# Altium schematic sheet Motor_Drivers.SchDoc
size 431 x 279 mm; SheetNumber: 4; SheetTotal: 4
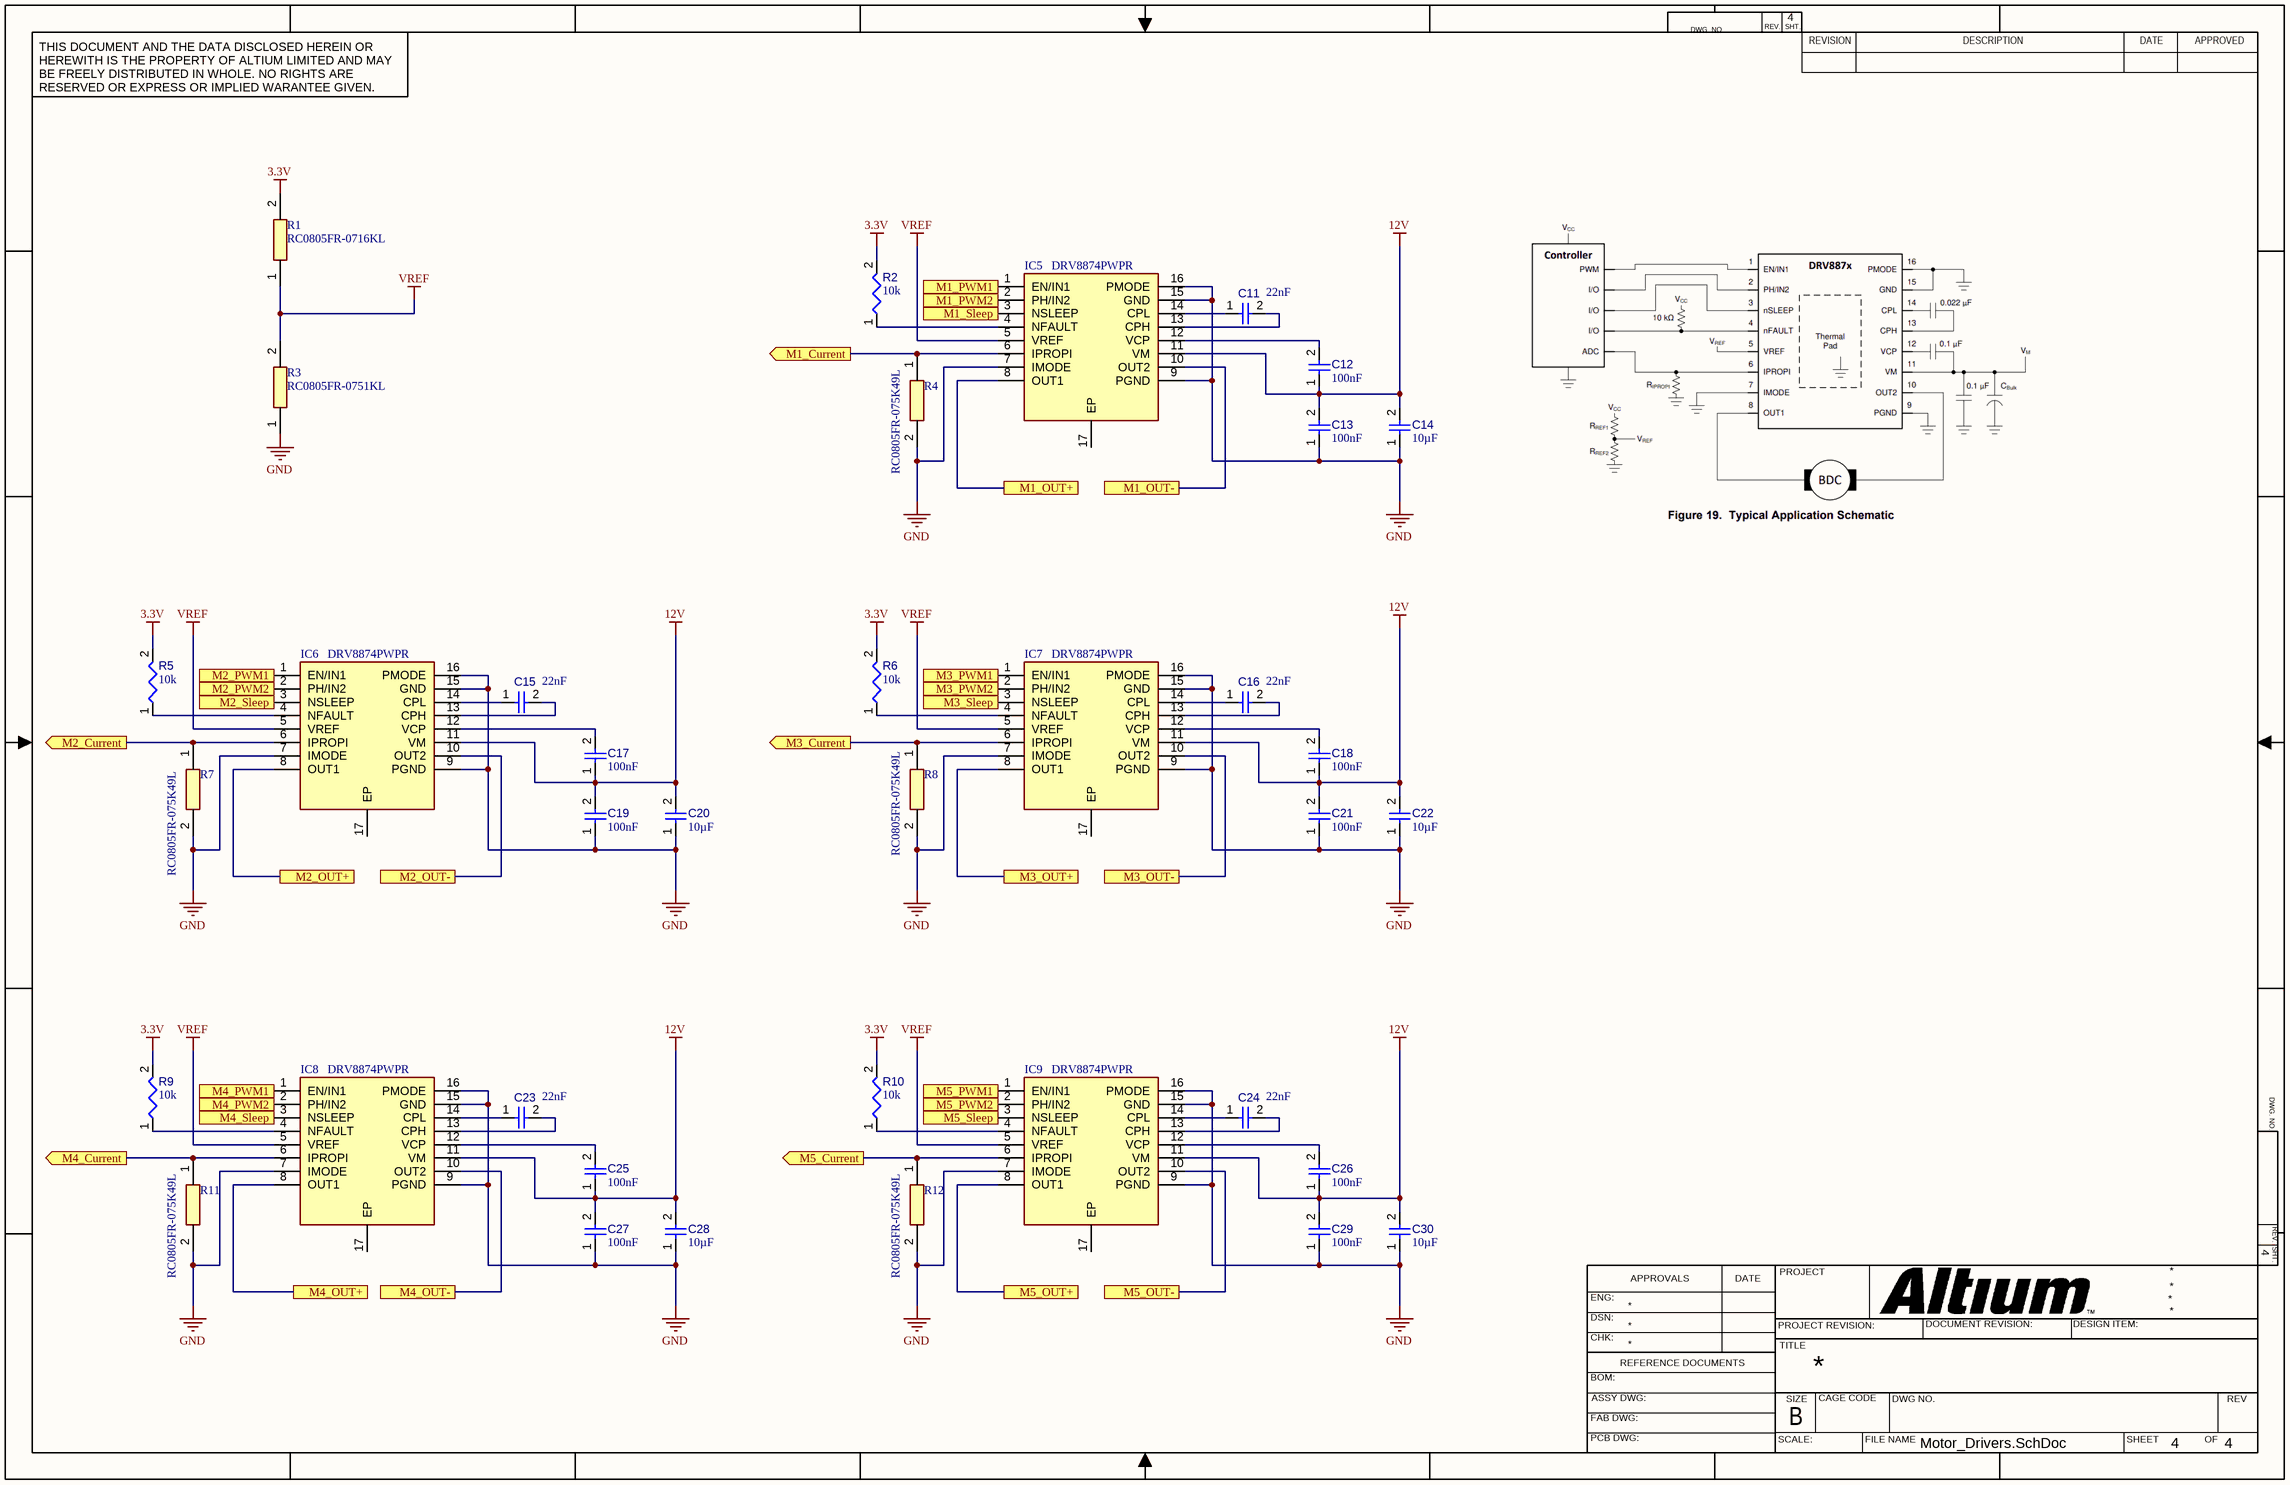
[diagram p0: Motor_Drivers.SchDoc]

## Parts
C11  value 22nF  [CAPC0402(1005)60_L]  (hidden comment: Capacitor 22nF +/-20% 10V 0402)
C12  value 100nF  [CAPC2013X95X50LL10T25]  (hidden comment: Capacitor 100 nF +/-10% 50 V 0805)
C13  value 100nF  [CAPC2013X95X50LL10T25]  (hidden comment: Capacitor 100 nF +/-10% 50 V 0805)
C14  value 10µF  [CAPC0805(2012)145_L]  (hidden comment: Capacitor 10µF +/-20% 25V 0805)
C15  value 22nF  [CAPC0402(1005)60_L]  (hidden comment: Capacitor 22nF +/-20% 10V 0402)
C16  value 22nF  [CAPC0402(1005)60_L]  (hidden comment: Capacitor 22nF +/-20% 10V 0402)
C17  value 100nF  [CAPC2013X95X50LL10T25]  (hidden comment: Capacitor 100 nF +/-10% 50 V 0805)
C18  value 100nF  [CAPC2013X95X50LL10T25]  (hidden comment: Capacitor 100 nF +/-10% 50 V 0805)
C19  value 100nF  [CAPC2013X95X50LL10T25]  (hidden comment: Capacitor 100 nF +/-10% 50 V 0805)
C20  value 10µF  [CAPC0805(2012)145_L]  (hidden comment: Capacitor 10µF +/-20% 25V 0805)
C21  value 100nF  [CAPC2013X95X50LL10T25]  (hidden comment: Capacitor 100 nF +/-10% 50 V 0805)
C22  value 10µF  [CAPC0805(2012)145_L]  (hidden comment: Capacitor 10µF +/-20% 25V 0805)
C23  value 22nF  [CAPC0402(1005)60_L]  (hidden comment: Capacitor 22nF +/-20% 10V 0402)
C24  value 22nF  [CAPC0402(1005)60_L]  (hidden comment: Capacitor 22nF +/-20% 10V 0402)
C25  value 100nF  [CAPC2013X95X50LL10T25]  (hidden comment: Capacitor 100 nF +/-10% 50 V 0805)
C26  value 100nF  [CAPC2013X95X50LL10T25]  (hidden comment: Capacitor 100 nF +/-10% 50 V 0805)
C27  value 100nF  [CAPC2013X95X50LL10T25]  (hidden comment: Capacitor 100 nF +/-10% 50 V 0805)
C28  value 10µF  [CAPC0805(2012)145_L]  (hidden comment: Capacitor 10µF +/-20% 25V 0805)
C29  value 100nF  [CAPC2013X95X50LL10T25]  (hidden comment: Capacitor 100 nF +/-10% 50 V 0805)
C30  value 10µF  [CAPC0805(2012)145_L]  (hidden comment: Capacitor 10µF +/-20% 25V 0805)
IC5  DRV8874PWPR  [SOP65P640X120-17N]
IC6  DRV8874PWPR  [SOP65P640X120-17N]
IC7  DRV8874PWPR  [SOP65P640X120-17N]
IC8  DRV8874PWPR  [SOP65P640X120-17N]
IC9  DRV8874PWPR  [SOP65P640X120-17N]
R1  RC0805FR-0716KL  [RESC2012X60N]
R2  value 10k  [RESC3216X60X45ML15T20]  (hidden comment: Resistor 10k +/-1% 1206 250 mW)
R3  RC0805FR-0751KL  [RESC2012X60N]
R4  RC0805FR-075K49L  [RESC2012X60N]
R5  value 10k  [RESC3216X60X45ML15T20]  (hidden comment: Resistor 10k +/-1% 1206 250 mW)
R6  value 10k  [RESC3216X60X45ML15T20]  (hidden comment: Resistor 10k +/-1% 1206 250 mW)
R7  RC0805FR-075K49L  [RESC2012X60N]
R8  RC0805FR-075K49L  [RESC2012X60N]
R9  value 10k  [RESC3216X60X45ML15T20]  (hidden comment: Resistor 10k +/-1% 1206 250 mW)
R10  value 10k  [RESC3216X60X45ML15T20]  (hidden comment: Resistor 10k +/-1% 1206 250 mW)
R11  RC0805FR-075K49L  [RESC2012X60N]
R12  RC0805FR-075K49L  [RESC2012X60N]

## Ports
M1_Current (out), M1_OUT+, M1_OUT-, M1_PWM1 (in), M1_PWM2 (in), M1_Sleep (in), M2_Current (out), M2_OUT+, M2_OUT-, M2_PWM1 (in), M2_PWM2 (in), M2_Sleep (in), M3_Current (out), M3_OUT+, M3_OUT-, M3_PWM1 (in), M3_PWM2 (in), M3_Sleep (in), M4_Current (out), M4_OUT+, M4_OUT-, M4_PWM1 (in), M4_PWM2 (in), M4_Sleep (in), M5_Current (out), M5_OUT+, M5_OUT-, M5_PWM1 (in), M5_PWM2 (in), M5_Sleep (in)

## Nets
3.3V: R1.2 R2.2 R5.2 R6.2 R9.2 R10.2
12V: C12.1 C13.2 C14.2 C17.1 C18.1 C19.2 C20.2 C21.2 C22.2 C25.1 C26.1 C27.2 C28.2 C29.2 C30.2 IC5.11(VM) IC6.11(VM) IC7.11(VM) IC8.11(VM) IC9.11(VM)
GND: C13.1 C14.1 C19.1 C20.1 C21.1 C22.1 C27.1 C28.1 C29.1 C30.1 IC5.7(IMODE) IC5.9(PGND) IC5.15(GND) IC5.16(PMODE) IC6.7(IMODE) IC6.9(PGND) IC6.15(GND) IC6.16(PMODE) IC7.7(IMODE) IC7.9(PGND) IC7.15(GND) IC7.16(PMODE) IC8.7(IMODE) IC8.9(PGND) IC8.15(GND) IC8.16(PMODE) IC9.7(IMODE) IC9.9(PGND) IC9.15(GND) IC9.16(PMODE) R3.1 R4.2 R7.2 R8.2 R11.2 R12.2
VREF: IC5.5(VREF) IC6.5(VREF) IC7.5(VREF) IC8.5(VREF) IC9.5(VREF) R1.1 R3.2
M1_Current: IC5.6(IPROPI) R4.1 ; port M1_Current
M1_OUT+: IC5.8(OUT1) ; port M1_OUT+
M1_OUT-: IC5.10(OUT2) ; port M1_OUT-
M1_PWM1: IC5.1(EN/IN1) ; port M1_PWM1
M1_PWM2: IC5.2(PH/IN2) ; port M1_PWM2
M1_Sleep: IC5.3(NSLEEP) ; port M1_Sleep
M2_Current: IC6.6(IPROPI) R7.1 ; port M2_Current
M2_OUT+: IC6.8(OUT1) ; port M2_OUT+
M2_OUT-: IC6.10(OUT2) ; port M2_OUT-
M2_PWM1: IC6.1(EN/IN1) ; port M2_PWM1
M2_PWM2: IC6.2(PH/IN2) ; port M2_PWM2
M2_Sleep: IC6.3(NSLEEP) ; port M2_Sleep
M3_Current: IC7.6(IPROPI) R8.1 ; port M3_Current
M3_OUT+: IC7.8(OUT1) ; port M3_OUT+
M3_OUT-: IC7.10(OUT2) ; port M3_OUT-
M3_PWM1: IC7.1(EN/IN1) ; port M3_PWM1
M3_PWM2: IC7.2(PH/IN2) ; port M3_PWM2
M3_Sleep: IC7.3(NSLEEP) ; port M3_Sleep
M4_Current: IC8.6(IPROPI) R11.1 ; port M4_Current
M4_OUT+: IC8.8(OUT1) ; port M4_OUT+
M4_OUT-: IC8.10(OUT2) ; port M4_OUT-
M4_PWM1: IC8.1(EN/IN1) ; port M4_PWM1
M4_PWM2: IC8.2(PH/IN2) ; port M4_PWM2
M4_Sleep: IC8.3(NSLEEP) ; port M4_Sleep
M5_Current: IC9.6(IPROPI) R12.1 ; port M5_Current
M5_OUT+: IC9.8(OUT1) ; port M5_OUT+
M5_OUT-: IC9.10(OUT2) ; port M5_OUT-
M5_PWM1: IC9.1(EN/IN1) ; port M5_PWM1
M5_PWM2: IC9.2(PH/IN2) ; port M5_PWM2
M5_Sleep: IC9.3(NSLEEP) ; port M5_Sleep
NetC11_1: C11.1 IC5.14(CPL)
NetC11_2: C11.2 IC5.13(CPH)
NetC12_2: C12.2 IC5.12(VCP)
NetC15_1: C15.1 IC6.14(CPL)
NetC15_2: C15.2 IC6.13(CPH)
NetC16_1: C16.1 IC7.14(CPL)
NetC16_2: C16.2 IC7.13(CPH)
NetC17_2: C17.2 IC6.12(VCP)
NetC18_2: C18.2 IC7.12(VCP)
NetC23_1: C23.1 IC8.14(CPL)
NetC23_2: C23.2 IC8.13(CPH)
NetC24_1: C24.1 IC9.14(CPL)
NetC24_2: C24.2 IC9.13(CPH)
NetC25_2: C25.2 IC8.12(VCP)
NetC26_2: C26.2 IC9.12(VCP)
NetIC5_4: IC5.4(NFAULT) R2.1
NetIC6_4: IC6.4(NFAULT) R5.1
NetIC7_4: IC7.4(NFAULT) R6.1
NetIC8_4: IC8.4(NFAULT) R9.1
NetIC9_4: IC9.4(NFAULT) R10.1

Not connected (* = marked no-connect by the designer): IC5 17(EP); IC6 17(EP); IC7 17(EP); IC8 17(EP); IC9 17(EP)

## Notes on the sheet
- DWG. NO.
- REV.
- SHT.
- THIS DOCUMENT AND THE DATA DISCLOSED HEREIN OR HEREWITH IS THE PROPERTY OF ALTIUM LIMITED AND MAY BE FREELY DISTRIBUTED IN WHOLE. NO RIGHTS ARE RESERVED OR EXPRESS OR IMPLIED WARANTEE GIVEN.
- REVISION
- DESCRIPTION
- DATE
- APPROVED
- ENG:
- APPROVALS
- PROJECT
- DSN:
- CHK:
- REFERENCE DOCUMENTS
- PROJECT REVISION:
- TITLE
- DOCUMENT REVISION:
- DESIGN ITEM:
- BOM:
- FAB DWG:
- PCB DWG:
- ASSY DWG:
- SCALE:
- SIZE
- B
- CAGE CODE
- FILE NAME
- DWG NO.
- SHEET
- OF
- REV

## Library data of the parts
C11 C15 C16 C23 C24 = CMP-001-00062-3: Chip Capacitor, 22nF +/-20%, 10V, 0402, Thickness 0.6 mm; Tolerance: 10%; Min Operating Temperature: -55°C; Case/Package: 0402; Pins: 2; Max Operating Temperature: 85°C; Mounting Technology: SMT; Voltage Rating: 10V
C12 C13 C17-C19 C21 C25-C27 C29 = CMP-001-00018-6: Chip Capacitor, 100 nF, +/- 10%, 50 V, 0805 (2012 Metric); Capacitor Type: Ceramic; Voltage Rating: 50V; Pins: 2; Max Operating Temperature: 125°C; Min Operating Temperature: -55°C; Mounting Technology: SM; Case/Package: 0805; RoHS Compliant: True; Tolerance: 10%
C14 C20 C22 C28 C30 = CMP-001-00079-4: Chip Capacitor, 10µF +/-20%, 25V, 0805, Thickness 1.45 mm; Tolerance: 10%; Max Operating Temperature: 85°C; Case/Package: 0805; Voltage Rating: 25V; Min Operating Temperature: -55°C; Mounting Technology: SMT; Pins: 2
IC5-IC9 = DRV8874PWPR: Integrated Circuit; Manufacturer_Name: Texas Instruments; Datasheet Link: https://www.ti.com/lit/gpn/DRV8874; Height: 1.2mm; Manufacturer_Part_Number: DRV8874PWPR; Mouser Part Number: 595-DRV8874PWPR; Mouser Price/Stock: https://www.mouser.co.uk/ProductDetail/Texas-Instruments/DRV8874PWPR?qs=mAH9sUMRCtvh%2FSU15ywmDA%3D%3D; Arrow Part Number: DRV8874PWPR; Arrow Price/Stock: https://www.arrow.com/en/products/drv8874pwpr/texas-instruments?region=europe
R1 = RC0805FR-0716KL: Resistor; Manufacturer_Name: YAGEO; Datasheet Link: https://www.yageo.com/upload/media/product/productsearch/datasheet/rchip/PYu-RC_Group_51_RoHS_L_11.pdf; Height: 0.6mm; Manufacturer_Part_Number: RC0805FR-0716KL
R2 R5 R6 R9 R10 = CMP-009-00016-5: Chip Resistor, 10 KOhm, +/- 1%, 0.25 W, -55 to 155 degC, 1206 (3216 Metric); Power: 250mW; Voltage Rating: 200V; Pins: 2; Max Operating Temperature: 155°C; Tolerance: 1%; RoHS Compliant: True; Case/Package: 1206; Min Operating Temperature: -55°C; Mounting Technology: SM
R3 = RC0805FR-0751KL: Resistor; Manufacturer_Name: KEMET; Datasheet Link: http://www.yageo.com/documents/recent/PYu-RC_Group_51_RoHS_L_10.pdf; Height: 0.6mm; Manufacturer_Part_Number: RC0805FR-0751KL; Mouser Part Number: 603-RC0805FR-0751KL; Mouser Price/Stock: https://www.mouser.com/Search/Refine.aspx?Keyword=603-RC0805FR-0751KL
R4 R7 R8 R11 R12 = RC0805FR-075K49L: Resistor; Manufacturer_Name: KEMET; Datasheet Link: http://www.yageo.com/documents/recent/PYu-RC_Group_51_RoHS_L_10.pdf; Height: 0.6mm; Manufacturer_Part_Number: RC0805FR-075K49L; Mouser Part Number: 603-RC0805FR-075K49L; Mouser Price/Stock: https://www.mouser.co.uk/ProductDetail/Yageo/RC0805FR-075K49L?qs=VLOqbHBAO5cAd3YpTUoSOQ%3D%3D; Arrow Part Number: RC0805FR-075K49L; Arrow Price/Stock: https://www.arrow.com/en/products/rc0805fr-075k49l/yageo